# EAGLE design ESC and CYTRON power (EAGLE 9.5.2)
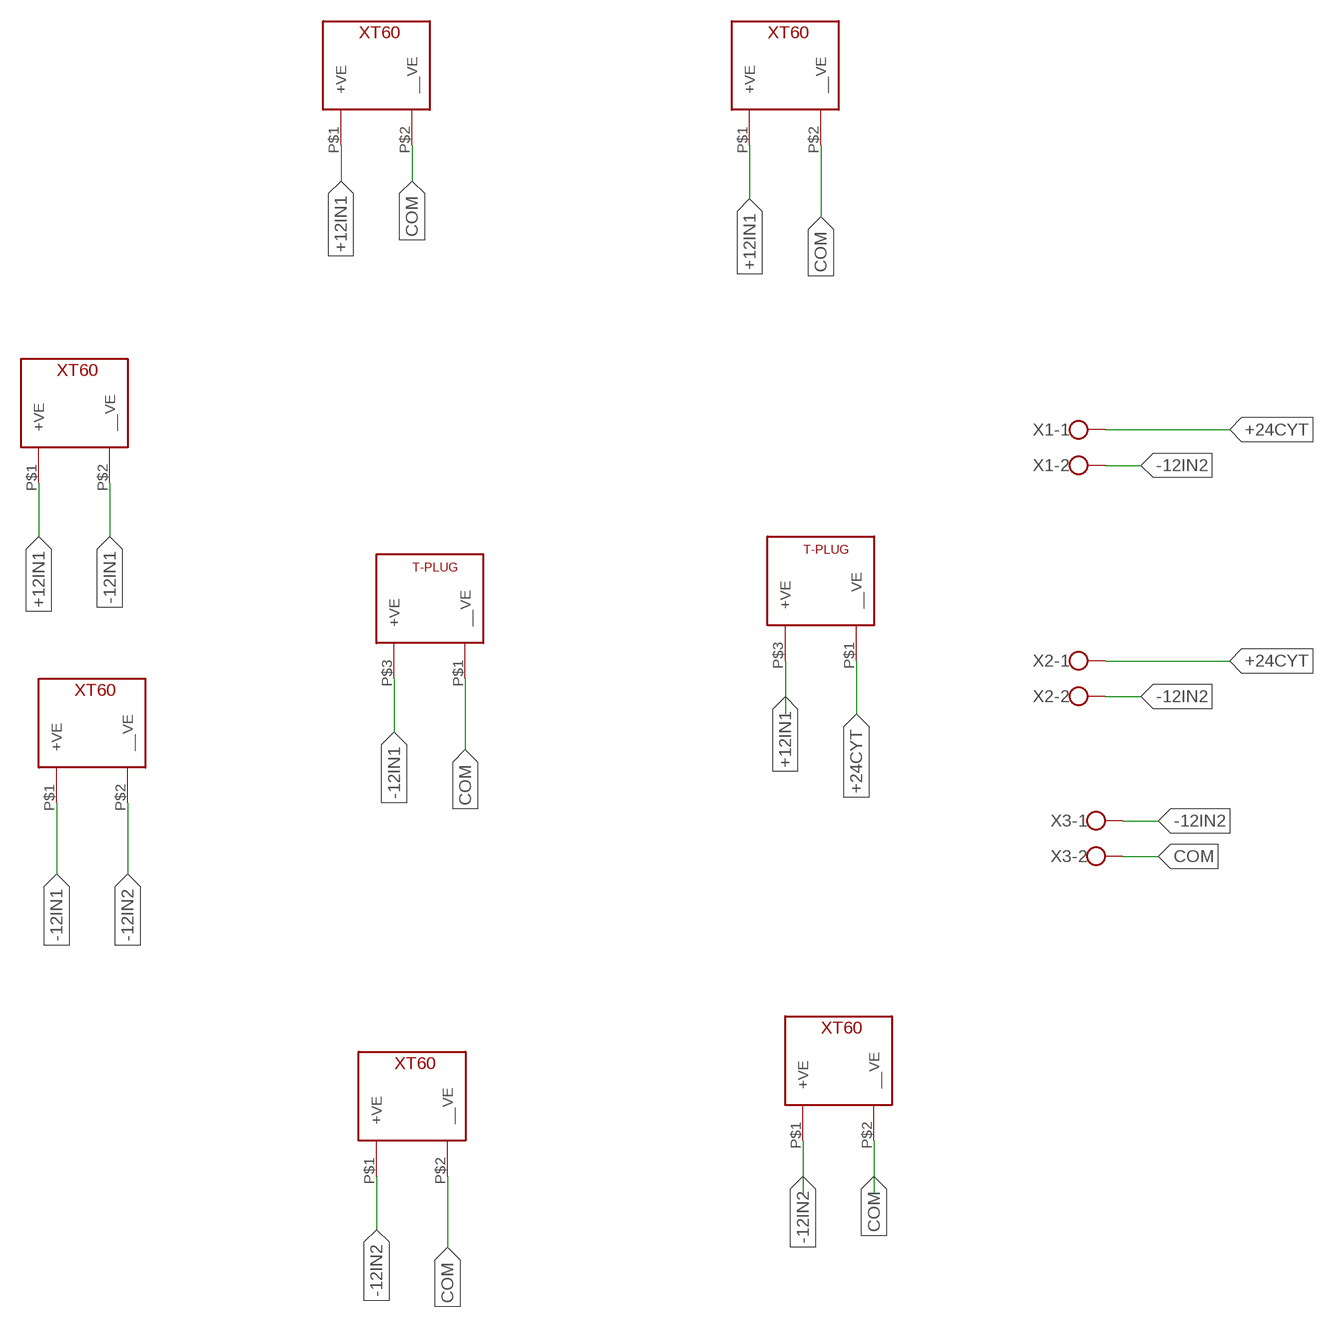
[diagram p0: schematic, sheet 1]

## Parts
BAT1  XT60_CONNECTOR  [XT60]
BAT2  XT60_CONNECTOR  [XT60]
CYT-SW  T_CONNECTOR  [T-PLUG]
ESC-B1  XT60_CONNECTOR  [XT60]
ESC-B2  XT60_CONNECTOR  [XT60]
ESC-SW  T_CONNECTOR  [T-PLUG]
ESC-T1  XT60_CONNECTOR  [XT60]
ESC-T2  XT60_CONNECTOR  [XT60]
X1  ROSTA.POWER  [W239-302]
X2  ROSTA.POWER  [W239-302]
X3  ROSTA.POWER  [W239-302]

## Nets
+12IN1: BAT1.P$1(+VE) CYT-SW.P$3(+VE) ESC-T1.P$1(+VE) ESC-T2.P$1(+VE)
+24CYT: CYT-SW.P$1(__VE) X1.1 X2.1
-12IN1: BAT1.P$2(__VE) BAT2.P$1(+VE) ESC-SW.P$3(+VE)
-12IN2: BAT2.P$2(__VE) ESC-B1.P$1(+VE) ESC-B2.P$1(+VE) X1.2 X2.2 X3.1
COM: ESC-B1.P$2(__VE) ESC-B2.P$2(__VE) ESC-SW.P$1(__VE) ESC-T1.P$2(__VE) ESC-T2.P$2(__VE) X3.2

## Library data of the parts
BAT1 BAT2 ESC-B1 ESC-B2 ESC-T1 ESC-T2 = MIA_LIBRARY-2-2-2:XT60_CONNECTOR
CYT-SW ESC-SW = MIA_LIBRARY-2-2-2:T_CONNECTOR
X1-X3 = MIA_LIBRARY-2-2-2:ROSTA.POWER: WAGO SCREW CLAMP; OC_FARNELL: unknown; OC_NEWARK: unknown

## Board
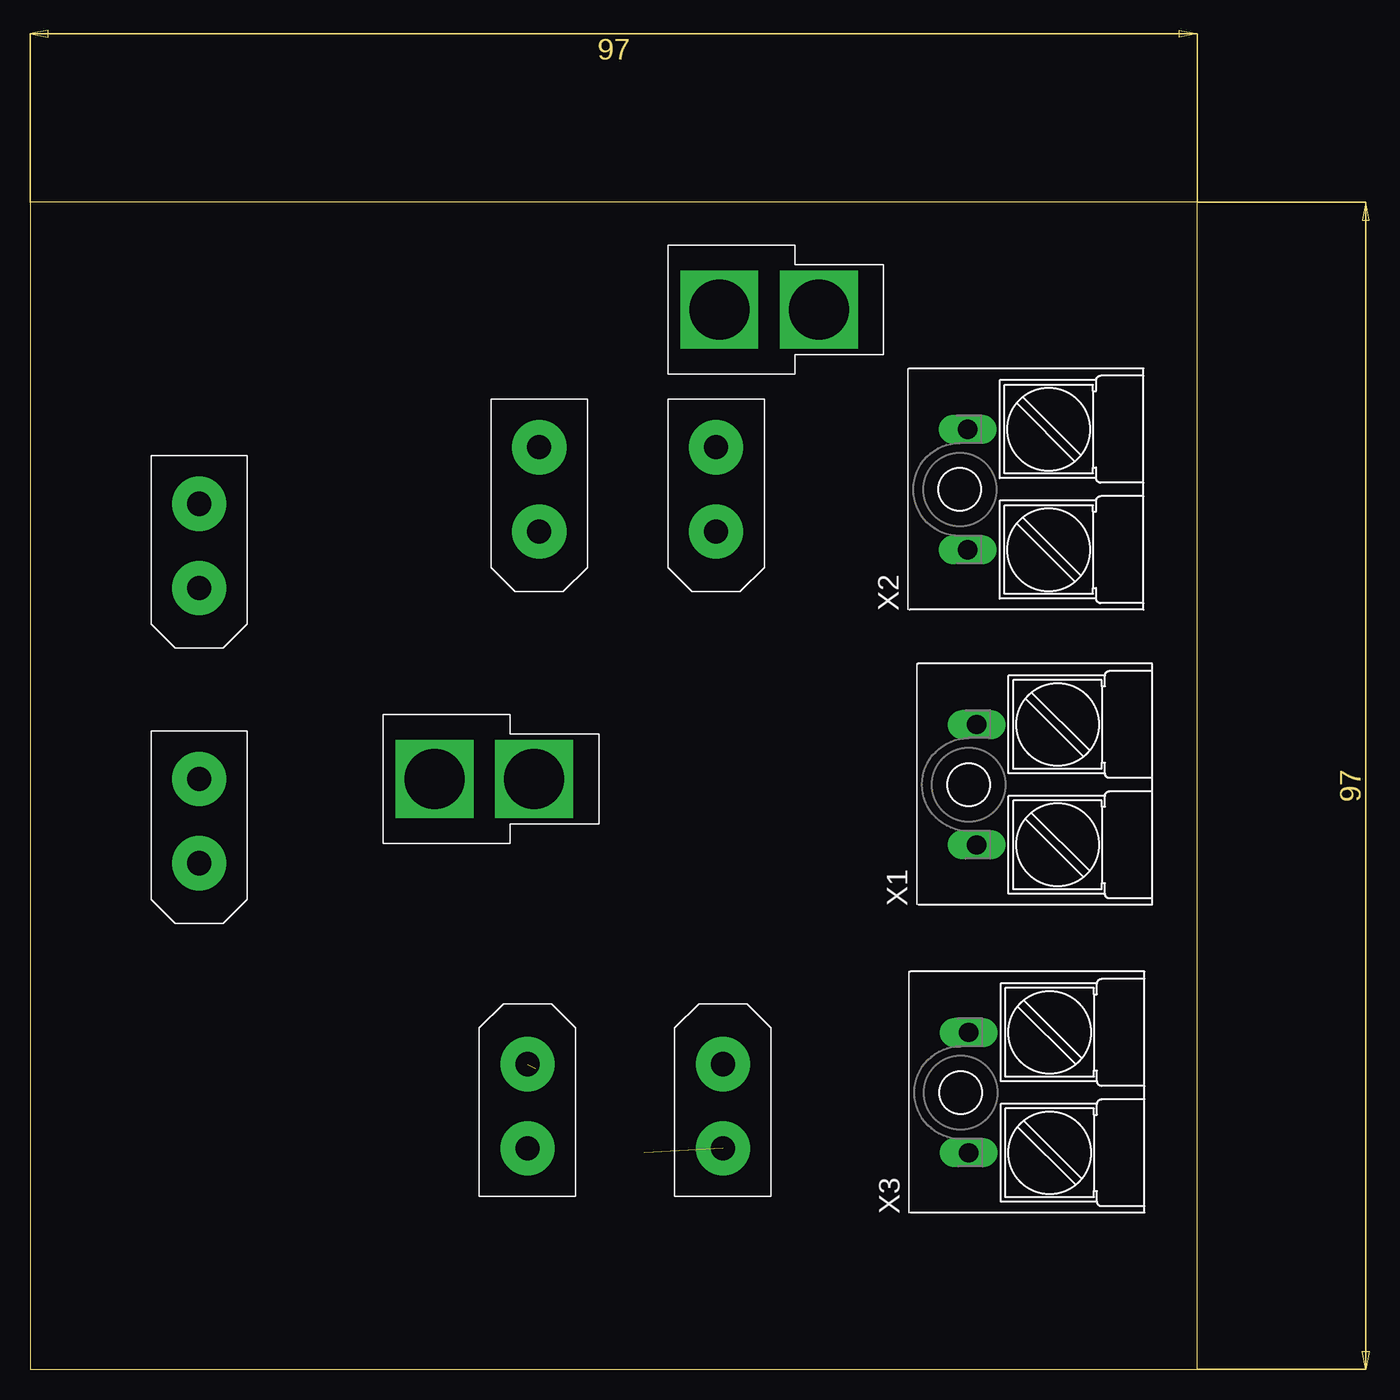
[diagram p1: board, top side]
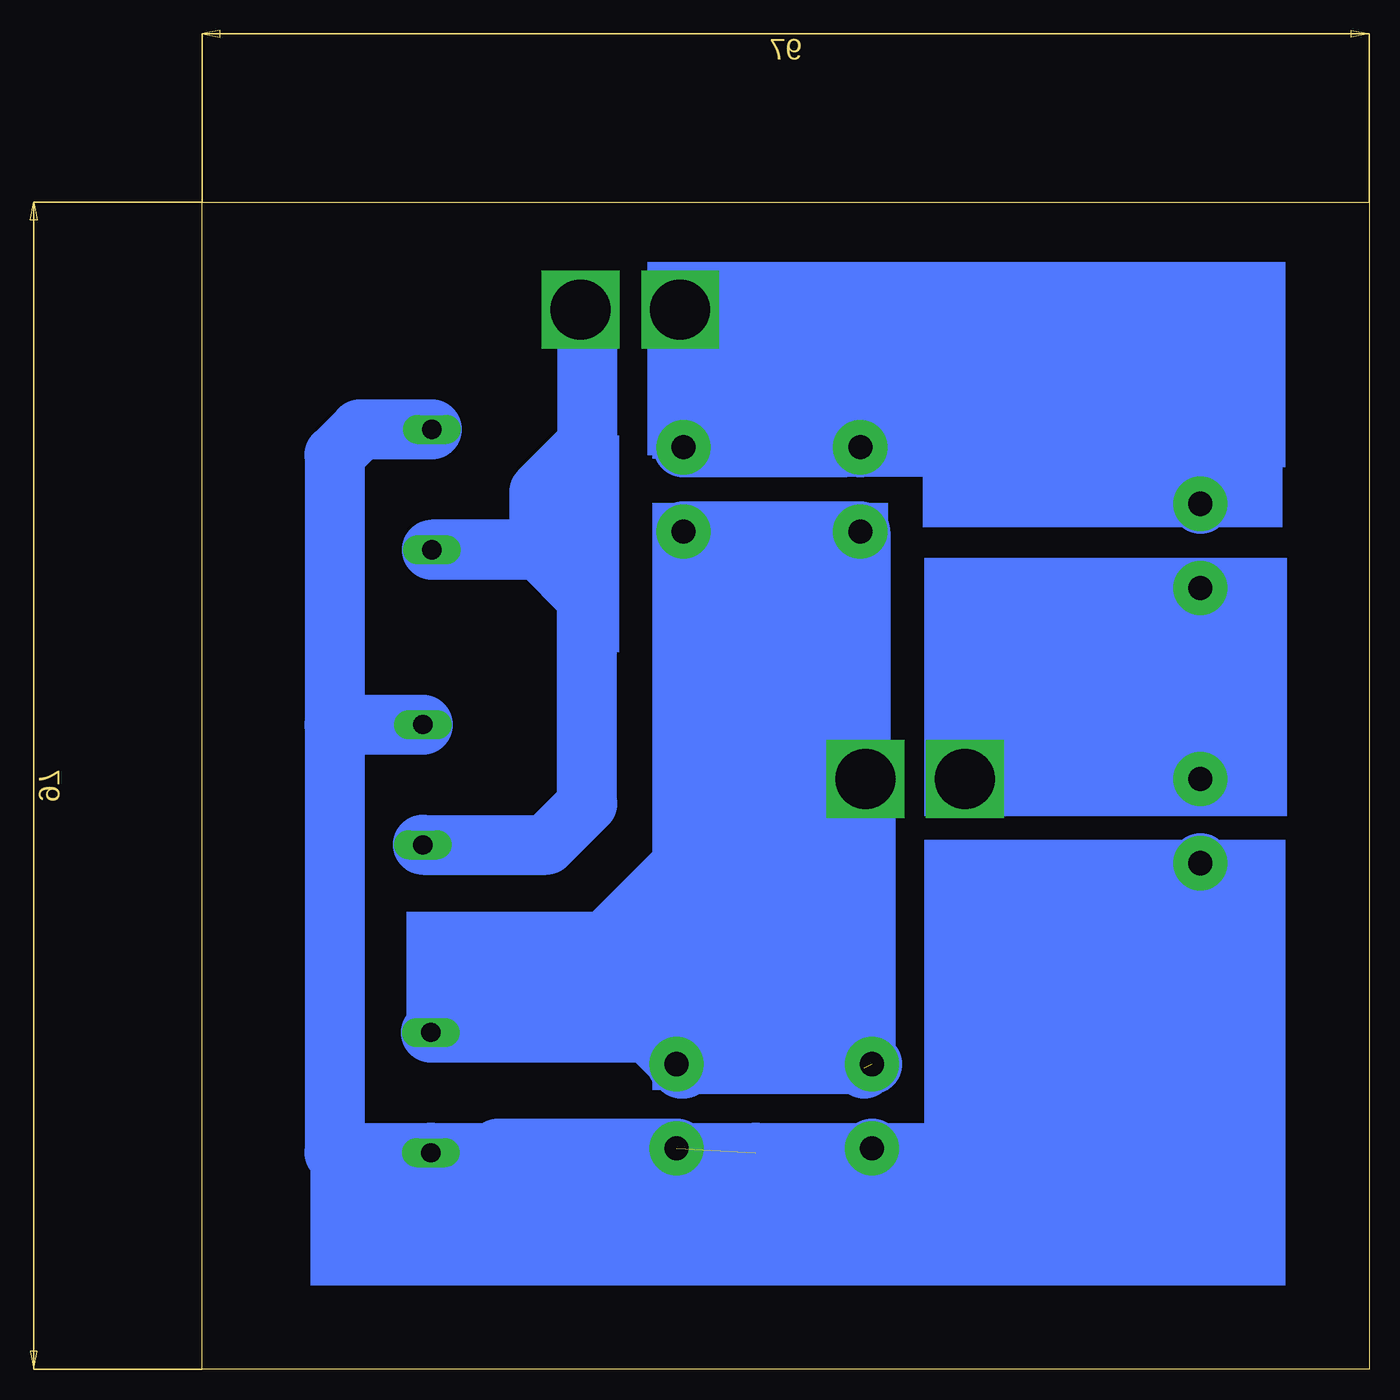
[diagram p2: board, bottom side, seen from below]

Size 97 x 97 mm. Coordinates in mm from the lower left corner, seen from the top.
Outline: 0,0 97,0 97,97 0,97 0,0
Copper layers (1*16): Top 0.035mm / dielectric 1.5mm / Bottom 0.035mm
Design rules "default": minimum track width 6mil, minimum drill 0.35mm, track to track 6mil, track to pad 6mil, pad to pad 6mil, via to via 6mil, smd to smd 6mil, copper to edge 40mil, drill to drill 6mil, minimum pad ring 10mil, minimum via ring 8mil, stop-mask expansion 4mil, vias tented up to drill 0mil, thermal gap 10mil

### Footprints (pad centres in the part's own frame; a part is rotated, then mirrored left to right if it is on the bottom)
XT60 = drill 2 pad 4.5: P$1 -4,-4; P$2 -11,-4
T-PLUG = drill 5 pad 6.452 square: P$1 -2.73,-4; P$3 -11,-4
W239-302 = drill 1.6 long: 1 -5,5; 2 5,5

### Placement (x,y rotation side)
BAT1  10.05,75.93 90 top
BAT2  10.05,53.07 90 top
CYT-SW  68.28,92.07 0 top
ESC-B1  61.57,14.37 270 top
ESC-B2  45.33,14.37 270 top
ESC-SW  44.61,53.07 0 top
ESC-T1  53.01,80.63 90 top
ESC-T2  38.31,80.63 90 top
X1  83.65,48.59 90 top
X2  82.92,73.12 90 top
X3  83,23 90 top

### Tracks (layer width: path | path; a pad name or v marks a point on that pad's centre or on a via)
+12IN1
  Bottom 5: ESC-T2.P$1 ESC-T1.P$1 43.72,76.63 | BAT1.P$1 18.75,76.63 ESC-T2.P$1 | ESC-T2.P$1 45.84,76.63 CYT-SW.P$3
+24CYT
  Bottom 5: CYT-SW.P$1 65,88.07 65,76.93 69,72.93 69,68.12 | 69.42,68.62 69.92,68.12 X2.1 69,68.12 | X1.1 68.41,43.59 65,47 65,64.12 69,68.12
-12IN1
  Bottom 5: BAT1.P$2 BAT2.P$1 ESC-SW.P$3
-12IN2  (1 unrouted)
  Bottom 5: BAT2.P$2 14.05,26.95 23,18 57.2,18 | ESC-B2.P$1 41.7,18 51,18 | X2.2 83.88,78.12 86,76 86,53.59 | 86,53.59 X1.2 | 72.37,18.37 ESC-B1.P$1 57.2,18 | 57.2,18 X3.1 86,18 86,53.59
COM  (1 unrouted)
  Bottom 5: ESC-T1.P$2 ESC-T2.P$2 42.31,48.31 42,48 41.88,48.12 ESC-SW.P$1 41.88,25.12 42,25 | ESC-B2.P$2 ESC-B1.P$2 57.2,25 57,25 60,28 X3.2
(copper drawn outside any net)
  shapes: Bottom area x12